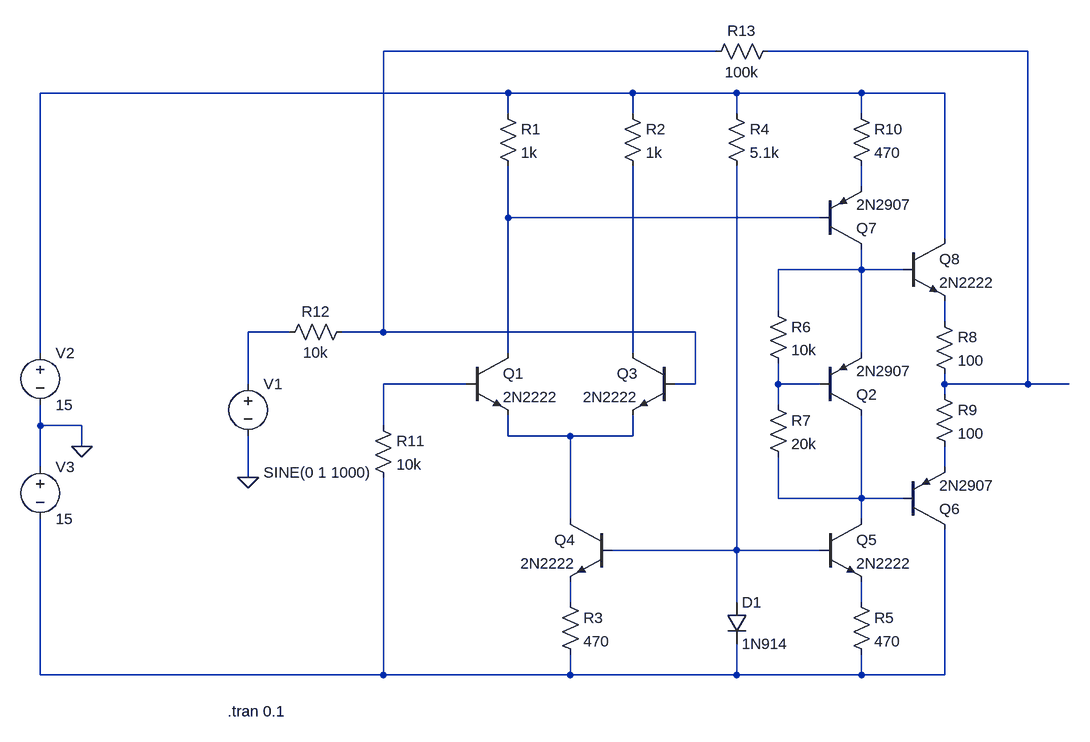
[diagram p0: schematic DiscreteOpamp.asc]
DiscreteOpamp.asc, the LTspice schematic file:
Version 4
SHEET 1 1188 824
WIRE 640 -208 128 -208
WIRE 1120 -208 720 -208
WIRE 320 -144 -400 -144
WIRE 512 -144 320 -144
WIRE 672 -144 512 -144
WIRE 864 -144 672 -144
WIRE 992 -144 864 -144
WIRE 320 -112 320 -144
WIRE 512 -112 512 -144
WIRE 672 -112 672 -144
WIRE 864 -112 864 -144
WIRE 864 0 864 -32
WIRE 320 48 320 -32
WIRE 800 48 320 48
WIRE 992 80 992 -144
WIRE 864 128 864 96
WIRE 864 128 736 128
WIRE 928 128 864 128
WIRE 736 192 736 128
WIRE 992 208 992 176
WIRE -16 224 -80 224
WIRE 128 224 128 -208
WIRE 128 224 64 224
WIRE 608 224 128 224
WIRE -400 256 -400 -144
WIRE 320 256 320 48
WIRE 512 256 512 -32
WIRE 864 256 864 128
WIRE -80 304 -80 224
WIRE 256 304 128 304
WIRE 608 304 608 224
WIRE 608 304 576 304
WIRE 736 304 736 272
WIRE 800 304 736 304
WIRE 992 304 992 288
WIRE 1120 304 1120 -208
WIRE 1120 304 992 304
WIRE 1184 304 1120 304
WIRE 992 320 992 304
WIRE 736 336 736 304
WIRE -400 368 -400 336
WIRE -336 368 -400 368
WIRE 128 368 128 304
WIRE 320 384 320 352
WIRE 416 384 320 384
WIRE 512 384 512 352
WIRE 512 384 416 384
WIRE -336 400 -336 368
WIRE -400 432 -400 368
WIRE 992 432 992 400
WIRE -80 448 -80 384
WIRE 736 480 736 416
WIRE 864 480 864 352
WIRE 864 480 736 480
WIRE 928 480 864 480
WIRE 416 512 416 384
WIRE 864 512 864 480
WIRE 672 560 672 -32
WIRE 672 560 480 560
WIRE 800 560 672 560
WIRE 416 640 416 608
WIRE 672 640 672 560
WIRE 864 640 864 608
WIRE -400 752 -400 512
WIRE 128 752 128 448
WIRE 128 752 -400 752
WIRE 416 752 416 720
WIRE 416 752 128 752
WIRE 672 752 672 704
WIRE 672 752 416 752
WIRE 864 752 864 720
WIRE 864 752 672 752
WIRE 992 752 992 528
WIRE 992 752 864 752
FLAG -336 400 0
FLAG -80 448 0
SYMBOL res 304 -128 R0
SYMATTR InstName R1
SYMATTR Value 1k
SYMBOL res 496 -128 R0
SYMATTR InstName R2
SYMATTR Value 1k
SYMBOL npn 256 256 R0
SYMATTR InstName Q1
SYMATTR Value 2N2222
SYMBOL pnp 800 352 M180
SYMATTR InstName Q2
SYMATTR Value 2N2907
SYMBOL npn 576 256 M0
SYMATTR InstName Q3
SYMATTR Value 2N2222
SYMBOL res 400 624 R0
SYMATTR InstName R3
SYMATTR Value 470
SYMBOL npn 480 512 M0
SYMATTR InstName Q4
SYMATTR Value 2N2222
SYMBOL diode 656 640 R0
SYMATTR InstName D1
SYMATTR Value 1N914
SYMBOL res 656 -128 R0
SYMATTR InstName R4
SYMATTR Value 5.1k
SYMBOL npn 800 512 R0
SYMATTR InstName Q5
SYMATTR Value 2N2222
SYMBOL res 848 624 R0
SYMATTR InstName R5
SYMATTR Value 470
SYMBOL pnp 928 528 M180
SYMATTR InstName Q6
SYMATTR Value 2N2907
SYMBOL pnp 800 96 M180
SYMATTR InstName Q7
SYMATTR Value 2N2907
SYMBOL res 720 176 R0
SYMATTR InstName R6
SYMATTR Value 10k
SYMBOL res 720 320 R0
SYMATTR InstName R7
SYMATTR Value 20k
SYMBOL npn 928 80 R0
SYMATTR InstName Q8
SYMATTR Value 2N2222
SYMBOL res 976 192 R0
SYMATTR InstName R8
SYMATTR Value 100
SYMBOL res 976 304 R0
SYMATTR InstName R9
SYMATTR Value 100
SYMBOL res 848 -128 R0
SYMATTR InstName R10
SYMATTR Value 470
SYMBOL res 112 352 R0
SYMATTR InstName R11
SYMATTR Value 10k
SYMBOL res 80 208 R90
WINDOW 0 0 56 VBottom 2
WINDOW 3 32 56 VTop 2
SYMATTR InstName R12
SYMATTR Value 10k
SYMBOL res 736 -224 R90
WINDOW 0 0 56 VBottom 2
WINDOW 3 32 56 VTop 2
SYMATTR InstName R13
SYMATTR Value 100k
SYMBOL voltage -80 288 R0
WINDOW 3 24 152 Left 2
WINDOW 123 24 124 Left 2
WINDOW 39 0 0 Left 0
SYMATTR Value SINE(0 1 1000)
SYMATTR InstName V1
SYMBOL voltage -400 240 R0
WINDOW 123 0 0 Left 0
WINDOW 39 0 0 Left 0
SYMATTR InstName V2
SYMATTR Value 15
SYMBOL voltage -400 416 R0
WINDOW 123 0 0 Left 0
WINDOW 39 0 0 Left 0
SYMATTR InstName V3
SYMATTR Value 15
TEXT -112 808 Left 2 !.tran 0.1

The netlist it stands for:
* DiscreteOpamp.asc
R1 N003 N005 1k
R2 N003 N009 1k
Q1 N005 N010 N012 0 2N2222
Q2 N014 N011 N006 0 2N2907
Q3 N009 N001 N012 0 2N2222
R3 N016 N018 470
Q4 N012 N015 N016 0 2N2222
D1 N015 N018 1N914
R4 N003 N015 5.1k
Q5 N014 N015 N017 0 2N2222
R5 N017 N018 470
Q6 N018 N014 N013 0 2N2907
Q7 N006 N005 N004 0 2N2907
R6 N006 N011 10k
R7 N011 N014 20k
Q8 N003 N006 N007 0 2N2222
R8 N007 N002 100
R9 N002 N013 100
R10 N003 N004 470
R11 N010 N018 10k
R12 N001 N008 10k
R13 N002 N001 100k
V1 N008 0 SINE(0 1 1000)
V2 N003 0 15
V3 0 N018 15
.model D D
.lib standard.dio
.model NPN NPN
.model PNP PNP
.lib standard.bjt
.tran 0.1
.backanno
.end